# EasyEDA schematic schematic.json
TITLE: Sheet_1; REV: 1.0; Date: 2025-01-11; Sheet: 1/1; Drawn By: kiya868858; Company: Your Company
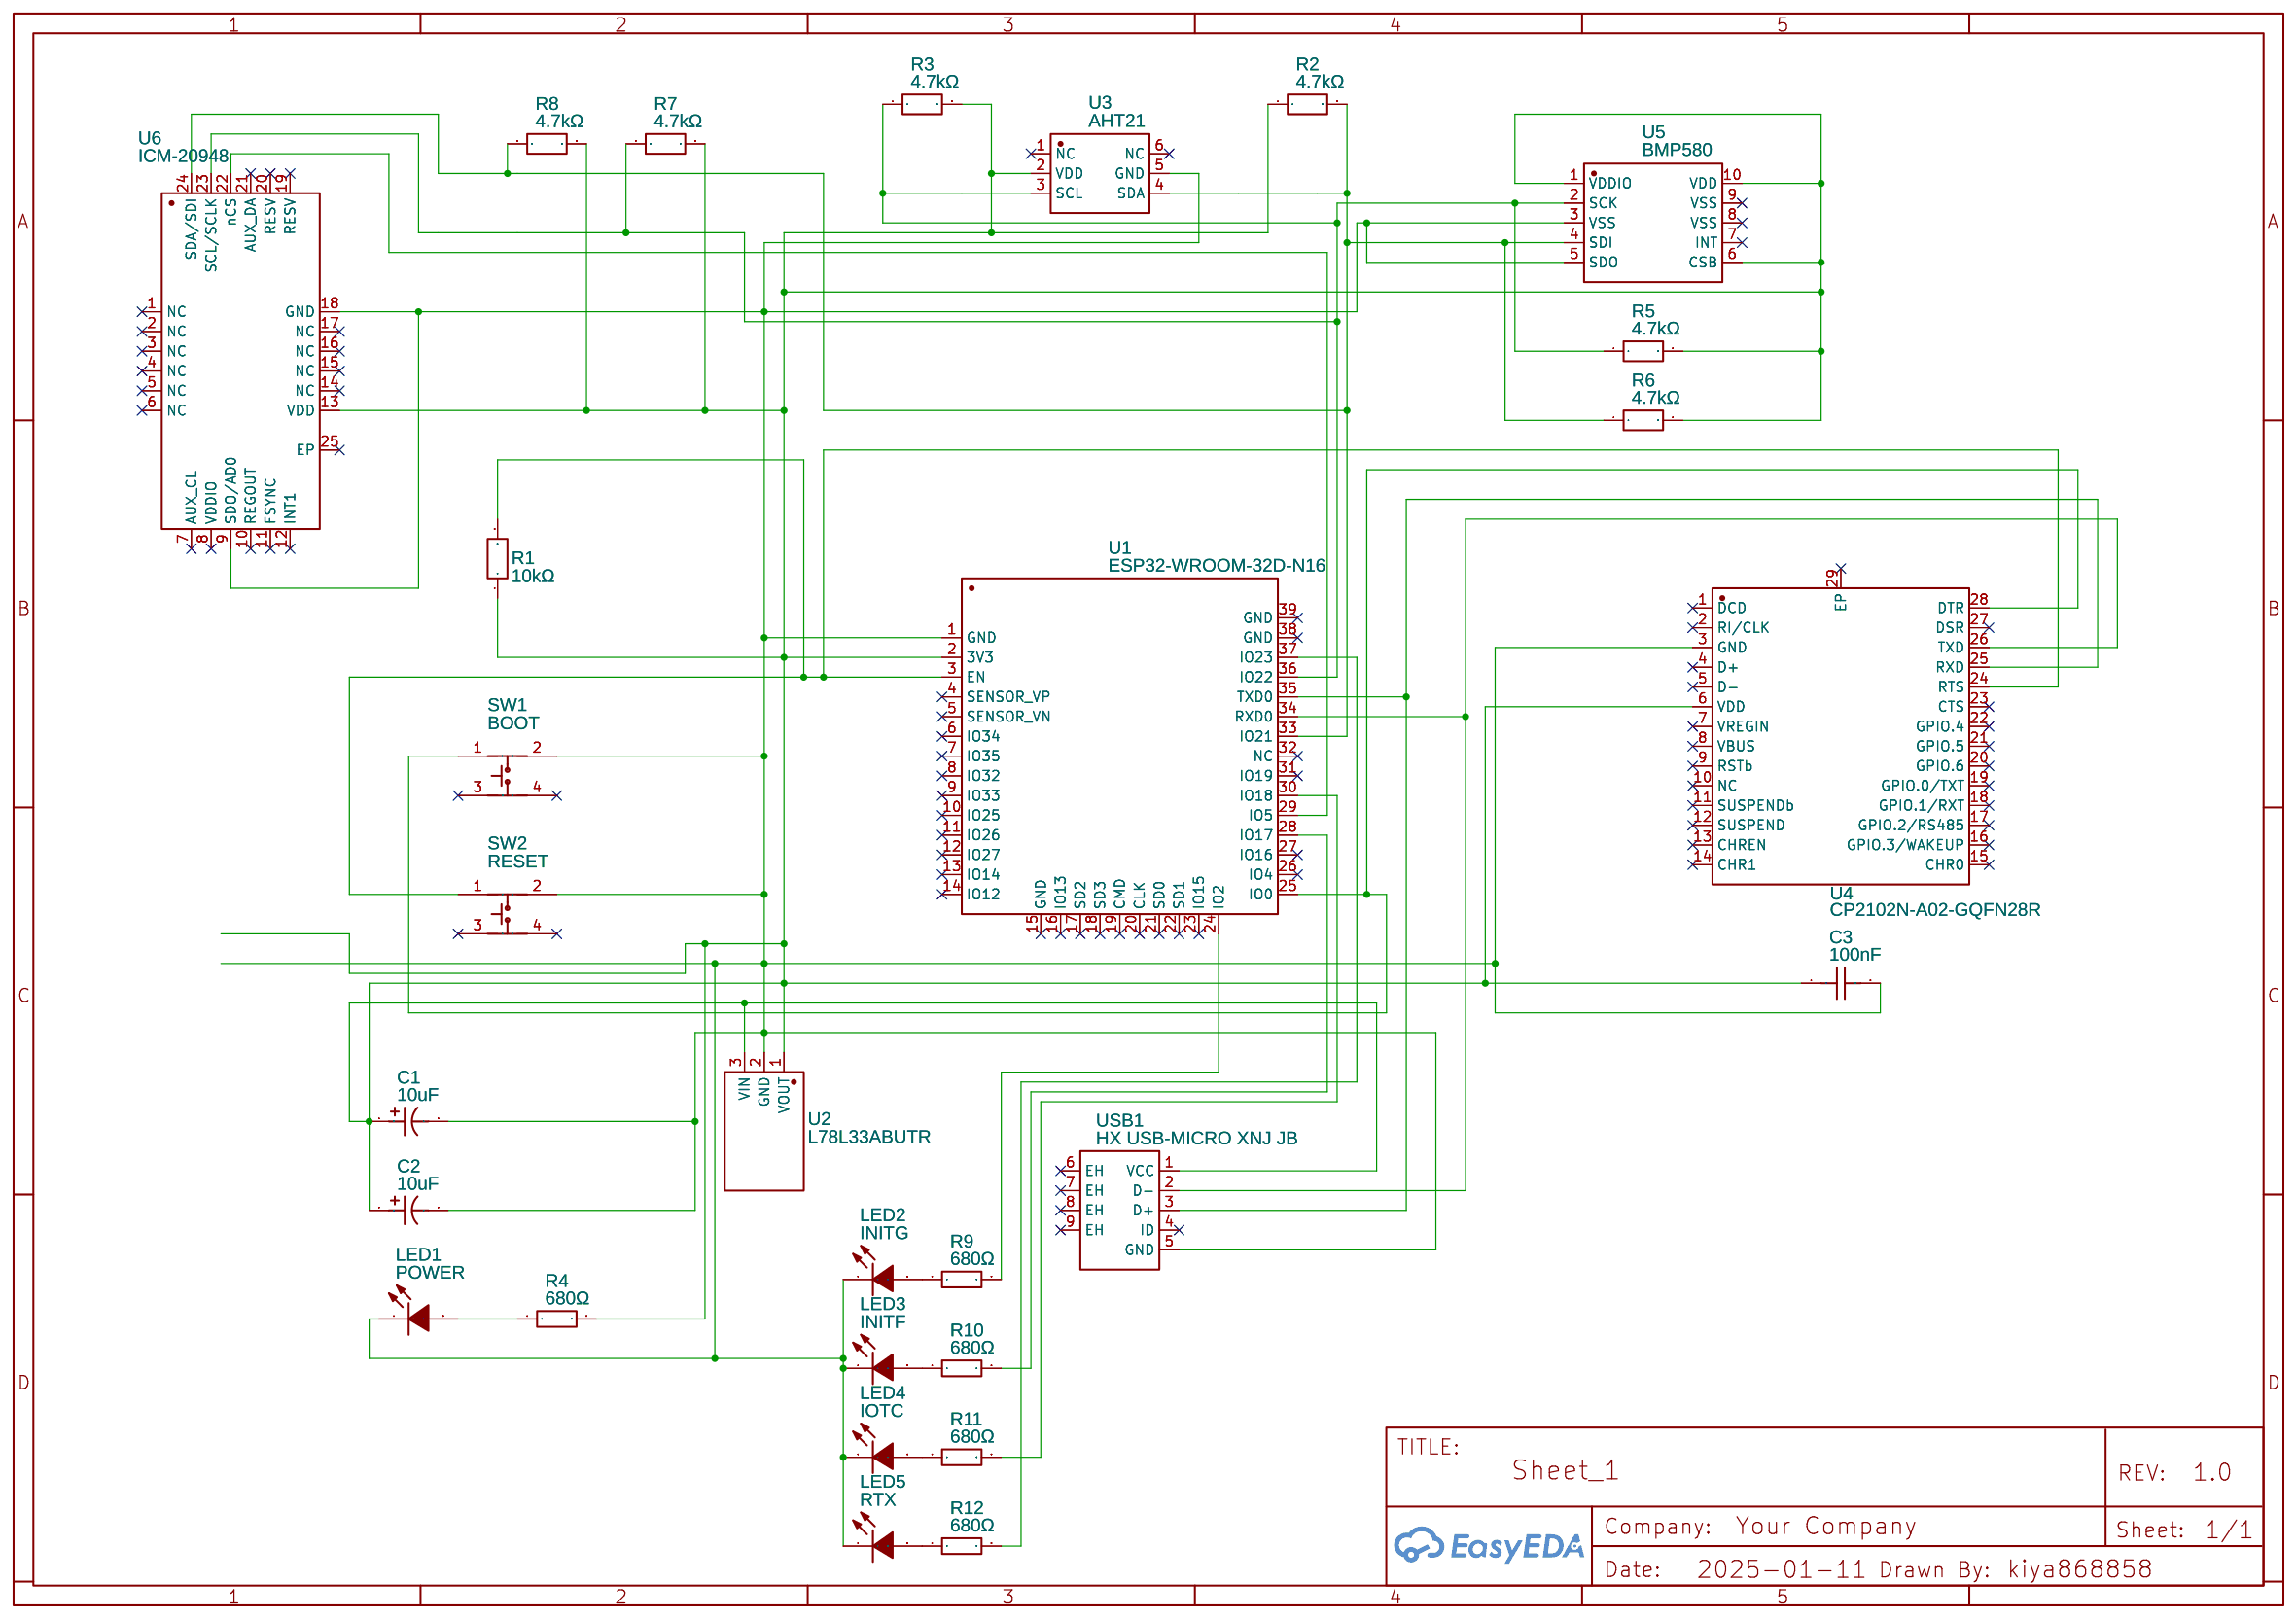
[diagram p0: schematic sheet]

## Parts
C1  10uF  [CASE-A_3216]
C2  10uF  [CASE-A_3216]
C3  100nF  [C0603]
LED1  POWER  [LED0603-RD]
LED2  INITG  [LED0603-RD]
LED3  INITF  [LED0603-RD]
LED4  IOTC  [LED0603-RD]
LED5  RTX  [LED0603-RD]
R1  10kΩ  [R0805]
R2  4.7kΩ  [R0805]
R3  4.7kΩ  [R0805]
R4  680Ω  [R0603]
R5  4.7kΩ  [R0805]
R6  4.7kΩ  [R0805]
R7  4.7kΩ  [R0805]
R8  4.7kΩ  [R0805]
R9  680Ω  [R0603]
R10  680Ω  [R0603]
R11  680Ω  [R0603]
R12  680Ω  [R0603]
SW1  BOOT  [KEY-SMD_4P-L4.2-W3.2-P2.20-LS4.6]
SW2  RESET  [KEY-SMD_4P-L4.2-W3.2-P2.20-LS4.6]
U1  ESP32-WROOM-32D-N16  [WIFIM-SMD_ESP32-WROOM-32D]
U2  L78L33ABUTR  [SOT-89-3_L4.5-W2.5-P1.50-LS4.2-TL]
U3  AHT21  [SENSOR-SMD_L3.0-W3.0-P1.00-BR]
U4  CP2102N-A02-GQFN28R  [QFN-28_L5.0-W5.0-P0.50-TL-EP3.3]
U5  BMP580  [LGA-10_L2.0-W2.0-P0.50-TL_BMP580]
U6  ICM-20948  [QFN-24_L3.0-W3.0-P0.40-BL-EP]
USB1  HX USB-MICRO XNJ JB  [MICRO-USB-SMD_HX-USB-MICRO-XNJ-JB]

## Library data of the parts
C1 C2 = T491A106K010AT_C1508940: Contributor: lcsc; Supplier: LCSC; Supplier Part: C1508940; Manufacturer: KEMET(基美); Manufacturer Part: T491A106K010AT; JLCPCB Part Class: Extended Part
C3 = GRM188R71H104KA93D: Supplier: LCSC; Manufacturer: muRata(村田); Supplier Part: C77055; JLCPCB Part Class: Extended Part
LED1-LED5 = LTST-C193KGKT-5A: Contributor: LCSC; JLCPCB Part Class: Extended Part; Supplier: LCSC; Manufacturer: LITEON(光宝); Supplier Part: C125102
R1 = CRCW080510K0FKEAHP: Supplier: LCSC; Supplier Part: C313823; Manufacturer: VISHAY(威世); JLCPCB Part Class: Extended Part; Contributor: lcsc
R2 R3 R5-R8 = CRCW08054K70JNEA: Contributor: LCSC; Supplier: LCSC; Supplier Part: C844631; Manufacturer: VISHAY(威世); JLCPCB Part Class: Extended Part
R4 R9-R12 = RC0603FR-07680RL: Supplier: LCSC; Manufacturer: YAGEO(国巨); Supplier Part: C112310; JLCPCB Part Class: Extended Part
SW1 SW2 = SKRPABE010: Supplier: LCSC; Manufacturer: ALPSALPINE(阿尔卑斯阿尔派); Supplier Part: C115360; JLCPCB Part Class: Extended Part
U1 = ESP32-WROOM-32D-N16: Contributor: lcsc; Supplier: LCSC; Supplier Part: C2973676; Manufacturer: null; Manufacturer Part: ESP32-WROOM-32D-N16-被合并; JLCPCB Part Class: Extended Part
U2 = L78L33ABUTR: Contributor: LCSC; Supplier: LCSC; Manufacturer: ST(意法半导体); Supplier Part: C81362; JLCPCB Part Class: Extended Part
U3 = AHT21: Contributor: LCSC; Supplier: LCSC; Supplier Part: C2827328; Manufacturer: 广州奥松; JLCPCB Part Class: Extended Part
U4 = CP2102N-A02-GQFN28R: Contributor: LCSC; Supplier: LCSC; Supplier Part: C964632; Manufacturer: SKYWORKS/SILICON LABS(芯科); JLCPCB Part Class: Extended Part
U5 = BMP580: Supplier: LCSC; Supplier Part: C22391138; Manufacturer: Bosch(博世); JLCPCB Part Class: Extended Part; Contributor: lcsc
U6 = ICM-20948: Contributor: lcsc; Supplier: LCSC; Supplier Part: C726001; Manufacturer: TDK InvenSense(应美盛); JLCPCB Part Class: Extended Part
USB1 = HX USB-MICRO XNJ JB: Supplier: LCSC; Supplier Part: C18357556; Manufacturer: hanxia(韩下); Contributor: lcsc; JLCPCB Part Class: Extended Part

## Nets
Net-(C1-1): C1.1 C2.1 C3.1 R1.1 R2.1 R3.2 R4.2 R5.2 R6.2 R7.2 R8.2 U1.2(3V3) U2.1(VOUT) U2.3(VIN) U3.2(VDD) U4.6(VDD) U5.1(VDDIO) U5.6(CSB) U5.10(VDD) U6.13(VDD) USB1.1(VCC)
Net-(C1-2): C1.2 C2.2 C3.2 LED1.1(-) LED2.1(-) LED3.1(-) LED4.1(-) LED5.1(-) SW1.2 SW2.2 U1.1(GND) U2.2(GND) U3.5(GND) U4.3(GND) U5.3(VSS) U5.5(SDO) U6.9(SDO/AD0) U6.18(GND) USB1.5(GND)
Net-(LED1-2): LED1.2(+) R4.1
Net-(LED2-2): LED2.2(+) R9.1
Net-(LED3-2): LED3.2(+) R10.1
Net-(LED4-2): LED4.2(+) R11.1
Net-(LED5-2): LED5.2(+) R12.1
Net-(R1-2): R1.2 SW2.1 U1.3(EN) U4.24(RTS)
Net-(R2-2): R2.2 R6.1 R8.1 U1.33(IO21) U3.4(SDA) U5.4(SDI) U6.24(SDA/SDI)
Net-(R3-1): R3.1 R5.1 R7.1 U1.36(IO22) U3.3(SCL) U5.2(SCK) U6.23(SCL/SCLK)
Net-(R9-2): R9.2 U1.24(IO2)
Net-(R10-2): R10.2 U1.28(IO17)
Net-(R11-2): R11.2 U1.30(IO18)
Net-(R12-2): R12.2 U1.37(IO23)
Net-(SW1-1): SW1.1 U1.25(IO0) U4.28(DTR)
Net-(U1-29): U1.29(IO5) U6.22(nCS)
Net-(U1-34): U1.34(RXD0) U4.26(TXD) USB1.2(D-)
Net-(U1-35): U1.35(TXD0) U4.25(RXD) USB1.3(D+)

Not connected (* = marked no-connect by the designer): SW1 3* 4*; SW2 3* 4*; U1 4(SENSOR_VP)* 5(SENSOR_VN)* 6(IO34)* 7(IO35)* 8(IO32)* 9(IO33)* 10(IO25)* 11(IO26)* 12(IO27)* 13(IO14)* 14(IO12)* 15(GND)* 16(IO13)* 17(SD2)* 18(SD3)* 19(CMD)* 20(CLK)* 21(SD0)* 22(SD1)* 23(IO15)* 26(IO4)* 27(IO16)* 31(IO19)* 32(NC)* 38(GND)* 39(GND)*; U3 1(NC)* 6(NC)*; U4 1(DCD)* 2(RI/CLK)* 4(D+)* 5(D-)* 7(VREGIN)* 8(VBUS)* 9(RSTb)* 10(NC)* 11(SUSPENDb)* 12(SUSPEND)* 13(CHREN)* 14(CHR1)* 15(CHR0)* 16(GPIO.3/WAKEUP)* 17(GPIO.2/RS485)* 18(GPIO.1/RXT)* 19(GPIO.0/TXT)* 20(GPIO.6)* 21(GPIO.5)* 22(GPIO.4)* 23(CTS)* 27(DSR)* 29(EP)*; U5 7(INT)* 8(VSS)* 9(VSS)*; U6 1(NC)* 2(NC)* 3(NC)* 4(NC)* 5(NC)* 6(NC)* 7(AUX_CL)* 8(VDDIO)* 10(REGOUT)* 11(FSYNC)* 12(INT1)* 14(NC)* 15(NC)* 16(NC)* 17(NC)* 19(RESV)* 20(RESV)* 21(AUX_DA)* 25(EP)*; USB1 4(ID)* 6(EH)* 7(EH)* 8(EH)* 9(EH)*
